# Altium schematic sheet Client_Node_PERIPHERALS.SchDoc: Project Vega - Client Node
size A4; DrawnBy: Jithendra H S; Revision: 1; SheetNumber: 4; SheetTotal: 7
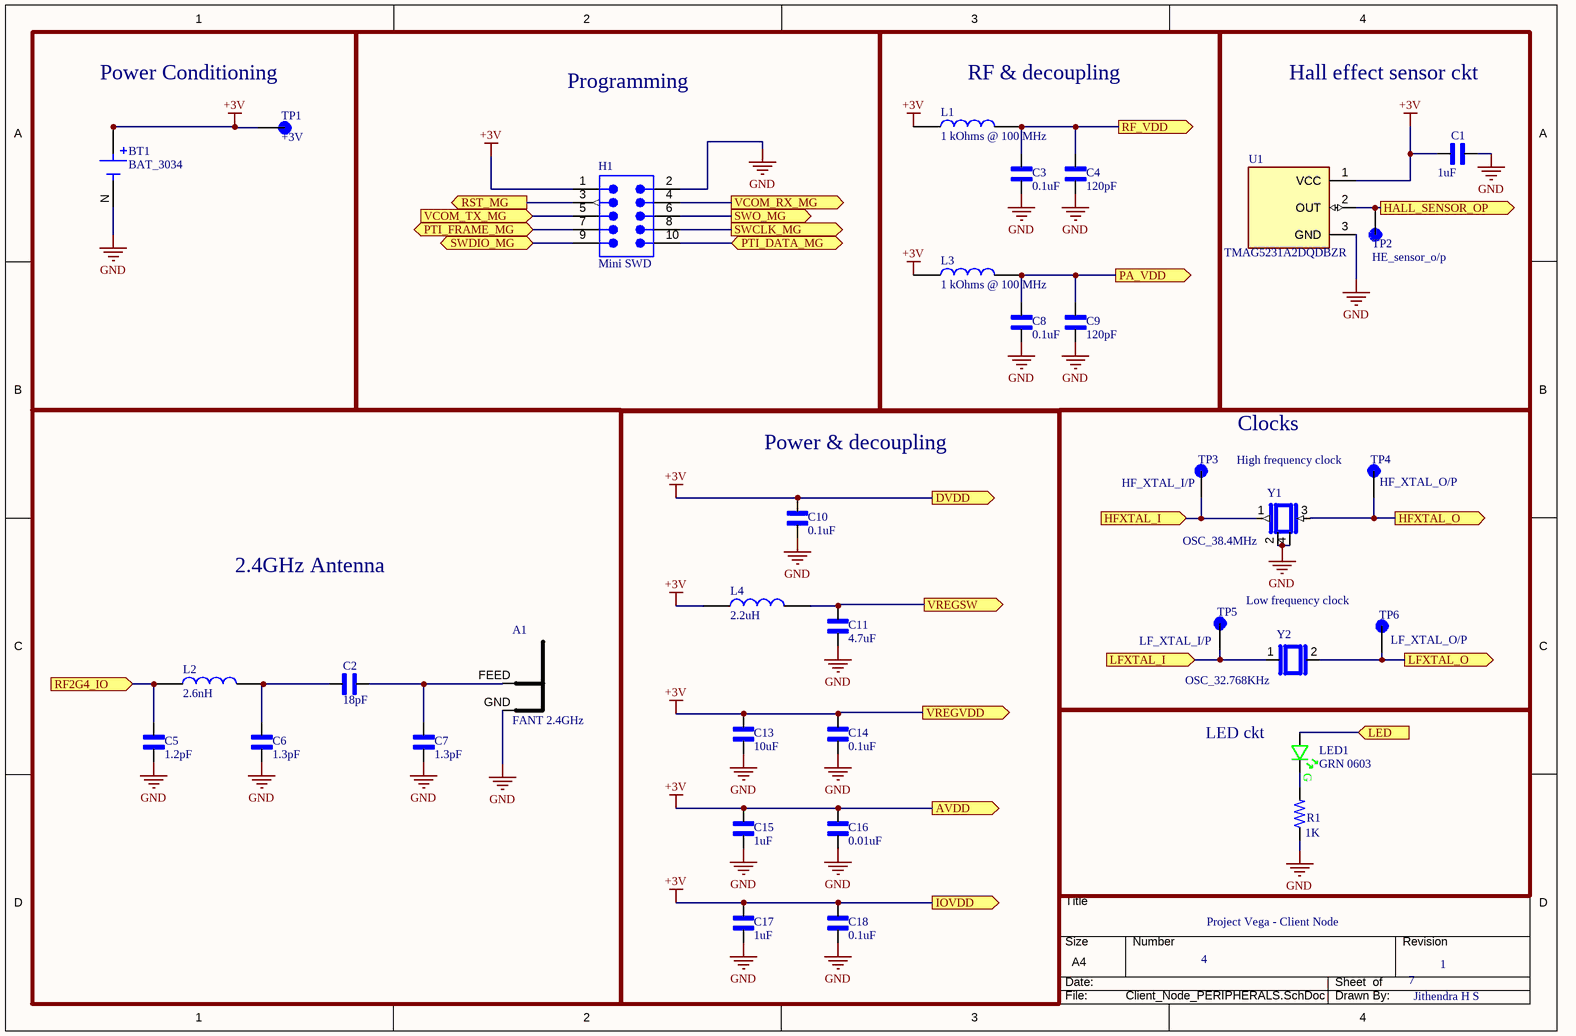
[diagram p0: Client_Node_PERIPHERALS.SchDoc]

## Parts
A1  FANT 2.4GHz  [FANT_2P4]
BT1  BAT_3034  [BAT_3034]
C1  1uF  [CAPC1608X90]
C2  18pF  [CAPC1608X90]
C3  0.1uF  [CAPC1608X90]
C4  120pF  [CAPC1608X90]
C5  1.2pF  [CAPC1608X90]
C6  1.3pF  [CAPC1608X90]
C7  1.3pF  [CAPC1608X90]
C8  0.1uF  [CAPC1608X90]
C9  120pF  [CAPC1608X90]
C10  0.1uF  [CAPC1608X90]
C11  4.7uF  [CAPC1608X90]
C13  10uF  [CAPC1608X90]
C14  0.1uF  [CAPC1608X90]
C15  1uF  [CAPC1608X90]
C16  0.01uF  [CAPC1608X90]
C17  1uF  [CAPC1608X90]
C18  0.1uF  [CAPC1608X90]
H1  Mini SWD  [FTSH-105-01-XXX-DV-K]
L1  1 kOhms @ 100 MHz  [INDC1608X95N]
L2  2.6nH  [INDC1608X95N]
L3  1 kOhms @ 100 MHz  [INDC1608X95N]
L4  2.2uH  [INDC1608X95N]
LED1  GRN 0603  [LED_0603_GRN_WL-SMCW]
R1  1K  [RES_0603]
TP1  +3V  [TP]
TP2  HE_sensor_o/p  [TP]
TP3  HF_XTAL_I/P  [TP]
TP4  HF_XTAL_O/P  [TP]
TP5  LF_XTAL_I/P  [TP]
TP6  LF_XTAL_O/P  [TP]
U1  TMAG5231A2DQDBZR  [SOT95P237X112-3N]
Y1  OSC_38.4MHz  [OSC_38.4MHz]
Y2  OSC_32.768KHz  [OSC_32.768KHz]

## Blocks framed on the sheet
Power Conditioning: BT1 TP1
Programming: H1
RF & decoupling: C3 C4 C8 C9 L1 L3
Hall effect sensor ckt: C1 TP2 U1
2.4GHz Antenna: A1 C2 C5-C7 L2
Clocks: TP3-TP6 Y1 Y2
Power & decoupling: C10 C11 C13-C18 L4
LED ckt: LED1 R1

## Ports
AVDD (out, see Client_Node_CPU[3B]), DVDD (out, see Client_Node_CPU[4A]), HALL_SENSOR_OP (out, see Client_Node_CPU[2D]), HFXTAL_I (in, see Client_Node_CPU[1A]), HFXTAL_O (out, see Client_Node_CPU[1A]), IOVDD (out, see Client_Node_CPU[3B]), LED (in, see Client_Node_CPU[2D]), LFXTAL_I (in, see Client_Node_CPU[2D]), LFXTAL_O (out, see Client_Node_CPU[2D]), PA_VDD (out), PTI_DATA_MG (bidir, see Client_Node_CPU[2D]), PTI_FRAME_MG (bidir, see Client_Node_CPU[2D]), RF2G4_IO (in, see Client_Node_CPU[2A]), RF_VDD (out), RST_MG (out, see Client_Node_CPU[3A]), SWCLK_MG (out, see Client_Node_CPU[2C]), SWDIO_MG (bidir, see Client_Node_CPU[2C]), SWO_MG (out, see Client_Node_CPU[2C]), VCOM_RX_MG (out, see Client_Node_CPU[2C]), VCOM_TX_MG (in, see Client_Node_CPU[2C]), VREGSW (out, see Client_Node_CPU[4A]), VREGVDD (out, see Client_Node_CPU[3A])

## Nets
+3V: BT1.P1(POS) BT1.P2(POS) C1.2 C10.1 C13.1 C14.1 C15.1 C16.1 C17.1 C18.1 H1.1 L1.1 L3.1 L4.1 TP1.TP U1.1(VCC) ; port DVDD, port VREGVDD, port AVDD, port IOVDD
GND: A1.GND BT1.N(NEG) C1.1 C3.2 C4.2 C5.2 C6.2 C7.2 C8.2 C9.2 C10.2 C11.2 C13.2 C14.2 C15.2 C16.2 C17.2 C18.2 H1.2 R1.1 U1.3(GND) Y1.2 Y1.4
HALL_SENSOR_OP: TP2.TP U1.2(OUT) ; port HALL_SENSOR_OP
HFXTAL_I: TP3.TP Y1.1 ; port HFXTAL_I
HFXTAL_O: TP4.TP Y1.3 ; port HFXTAL_O
LED: LED1.A ; port LED
LFXTAL_I: TP5.TP Y2.1 ; port LFXTAL_I
LFXTAL_O: TP6.TP Y2.2 ; port LFXTAL_O
PA_VDD: C8.1 C9.1 L3.2 ; port PA_VDD
PTI_DATA_MG: H1.10 ; port PTI_DATA_MG
PTI_FRAME_MG: H1.7 ; port PTI_FRAME_MG
RF2G4_IO: C5.1 L2.1 ; port RF2G4_IO
RF_VDD: C3.1 C4.1 L1.2 ; port RF_VDD
RST_MG: H1.3 ; port RST_MG
SWCLK_MG: H1.8 ; port SWCLK_MG
SWDIO_MG: H1.9 ; port SWDIO_MG
SWO_MG: H1.6 ; port SWO_MG
VCOM_RX_MG: H1.4 ; port VCOM_RX_MG
VCOM_TX_MG: H1.5 ; port VCOM_TX_MG
VREGSW: C11.1 L4.2 ; port VREGSW
NetA1_FEED: A1.FEED C2.2 C7.1
NetC2_1: C2.1 C6.1 L2.2
NetLED1_C: LED1.C R1.2

## Notes on the sheet
- (near TP4) High frequency clock
- Low frequency clock
- THIS DOCUMENT AND THE DATA DISCLOSED HEREIN OR
- HEREWITH IS THE PROPERTY OF ALTIUM LIMITED AND MAY
- DWG NO:
- REVISION
- REV:
- DESCRIPTION
- DATE
- APPROVED
- BE FREELY DISTRIBUTED IN WHOLE. NO RIGHTS ARE
- RESERVED OR EXPRESS OR IMPLIED WARANTEE GIVEN.
- ENG:
- APPROVALS
- PROJECT
- DSN:
- CHK:
- REFERENCE DOCUMENTS
- PROJECT REVISION:
- TITLE
- DOCUMENT REVISION:
- DESIGN ITEM:
- BOM:
- FAB DWG:
- PCB DWG:
- ASSY DWG:
- SCALE:
- A3
- SIZE
- CAGE CODE
- FILE NAME
- DWG NO.
- SHEET
- OF
- REV
- (in symbol LED_green) G

## Library data of the parts
A1 = FANT_2P4: Inverted F antenna
BT1 = BAT_3034: SMT Holder for 20mm Cell-Tin Nickel Plate; MP: 3034; MF: Keystone Electronics Corp.; SnapEDA_Link: https://www.snapeda.com/parts/3034/Keystone+Electronics/view-part/?ref=snap; Price: None; Check_prices: https://www.snapeda.com/parts/3034/Keystone+Electronics/view-part/?ref=eda; Availability: Not in stock; Value: *; Package: None; Supplier 1: Digikey; Supplier Part Number 1: 36-3034-ND
C1-C11 C13-C18 = CC0603KRX7R9BB104: 0.1 ÂµF Â±10% 50V Ceramic Capacitor X7R 0603 (1608 Metric); MF: Yageo; SnapEDA_Link: https://www.snapeda.com/parts/CC0603KRX7R9BB104/Yageo/view-part/?ref=snap; Package: 0603 Yageo; Value: *; MP: CC0603KRX7R9BB104; Check_prices: https://www.snapeda.com/parts/CC0603KRX7R9BB104/Yageo/view-part/?ref=eda
H1 = Debug Connector Mini SWD - 0.05": Mini SWD 0.05" Pitch Connector - 10 Pin SMT Box Header; Manufacturer: Adafruit Industries; Manufacturer Part Number: 4048; RoHS: No; Category: Connectors; Stock 1: 201; Pricing 1: 1=1.95000 (USD); ComponentLink1URL: https://media.digikey.com/pdf/Data%20Sheets/Adafruit%20PDFs/4048_Web.pdf?src-supplier=Digi-Key; ComponentLink1Description: https://media.digikey.com/pdf/Data%20Sheets/Adafruit%20PDFs/4048_Web.pdf?src-supplier=Digi-Key; Supplier 1: Digikey; Supplier Part Number 1: 1528-2827-ND
L1-L4 = LQM18DN100M70L: Inductor with Inductance 10uH Tol.+/-20% Package 0603 (1608); MF: Murata Electronics; MP: LQM18DN100M70L; Price: None; SnapEDA_Link: https://www.snapeda.com/parts/LQM18DN100M70L/Murata/view-part/4834755/?ref=snap; Package: 0603 Murata; Availability: Unavailable; Value: *
LED1 = LED_green: LED, 0603, GREEN, 430MCD, 520NM; Manufacturer: Wurth Electronics; Manufacturer Part Number: 150060GS75000; Dynamic Catalog: 0603 Rectangle with Flat Top Chip LEDs; 3D Model: SMCW_0603.igs / SMCW_0603.stp / SMCW_0603.wrl; Wavelength - Peak: 515nm; Voltage - Forward (Vf) (Typ): 3.2V; Current - Test: 20mA; Viewing Angle: 140°; Lens Type: Clear; Lens Style/Size: Rectangle with Flat Top, 1.1mm x 0.7mm; Other Names: 732-4971-2; Supplier 1: Digi-Key; Stock 1: 34964; Pricing 1: 1=0.14, 50=0.129, 100=0.11, 500=0.095 (USD); Standard Package: 4,000; Category: Optoelectronics; Family: LED Indication - Discrete; Series: WL-SMCW; Packaging: Tape & Reel (TR); Color: Green; Wavelength - Dominant: 520nm; Millicandela Rating: 430mcd; Package / Case: 0603 (1608 Metric); Size / Dimension: 1.60mm L x 0.80mm W; Height: 0.70mm; Mounting Type: Surface Mount; Online Catalog: 0603 Rectangle with Flat Top Chip LEDs; ComponentLink1URL: https://katalog.we-online.de/led/datasheet/150060GS75000.pdf?src-supplier=Digi-Key; ComponentLink1Description: https://katalog.we-online.de/led/datasheet/150060GS75000.pdf?src-supplier=Digi-Key; ComponentLink2URL: http://www.produktinfo.conrad.com/datenblaetter/750000-774999/759427-da-01-en-CHIPLED_0603_W_KL_GRUEN_150060GS75000.pdf?src-supplier=Conrad; ComponentLink2Description: http://www.produktinfo.conrad.com/datenblaetter/750000-774999/759427-da-01-en-CHIPLED_0603_W_KL_GRUEN_150060GS75000.pdf?src-supplier=Conrad; Supplier Part Number 1: 732-4971-1-ND
R1 = RES_0603: Thick film general purpose resistor 0603; MP: RC0603JR-070RL; Availability: Unavailable; Package: None; Value: *; Price: None
TP1-TP6 = Test_point: SMT Test Point- Mininature-1000 pc Reels; MP: 5019; MF: Keystone Electronics; Value: *; Availability: In Stock; Purchase-URL: https://pricing.snapeda.com/search/part/5019/?ref=eda; Package: None; Price: None
U1 = TMAG5231A2DQDBZR: SOT-23-3-Digital Switch Omnipolar Switch Push-Pull Hall Effect; MF: {'manufacturer': u'Texas Instruments'}; Package: None; Price: None; Value: *; MP: TMAG5231A2DQDBZR; Availability: Unavailable; Supplier 1: Digikey; Supplier Part Number 1: 296-TMAG5231A2DQDBZRCT-ND
Y1 = OSC_38.4MHz: 38.4 MHz ±10ppm Crystal 10pF 40 Ohms 4-SMD, No Lead; MF: {'manufacturer': u'Murata Electronics'}; MP: XRCGB38M400F2P00R0; Package: None; Price: None; Value: *; Availability: Unavailable; Supplier 1: Digikey; Supplier Part Number 1: 4606-TZ3398BCT-ND
Y2 = OSC_32.768KHz: Tuning Fork Crystal 32.768kHz in 1.2 x 2.0mm package; MF: Micro Crystal; MP: CM8V-T1A-32.768KHZ-7PF-20PPM-TA-QC; Package: SMD-2 Micro Crystal; Price: None; Value: *; SnapEDA_Link: https://www.snapeda.com/parts/CM8V-T1A-32.768KHZ-7PF-20PPM-TA-QC/Micro+Crystal/view-part/?ref=snap; Availability: Not in stock; Check_prices: https://www.snapeda.com/parts/CM8V-T1A-32.768KHZ-7PF-20PPM-TA-QC/Micro+Crystal/view-part/?ref=eda; Supplier 1: Digikey; Supplier Part Number 1: 2195-CM8V-T1A-32.768KHZ-7PF-20PPM-TA-QCCT-ND